# Altium schematic sheet AICat.SchDoc
size A3
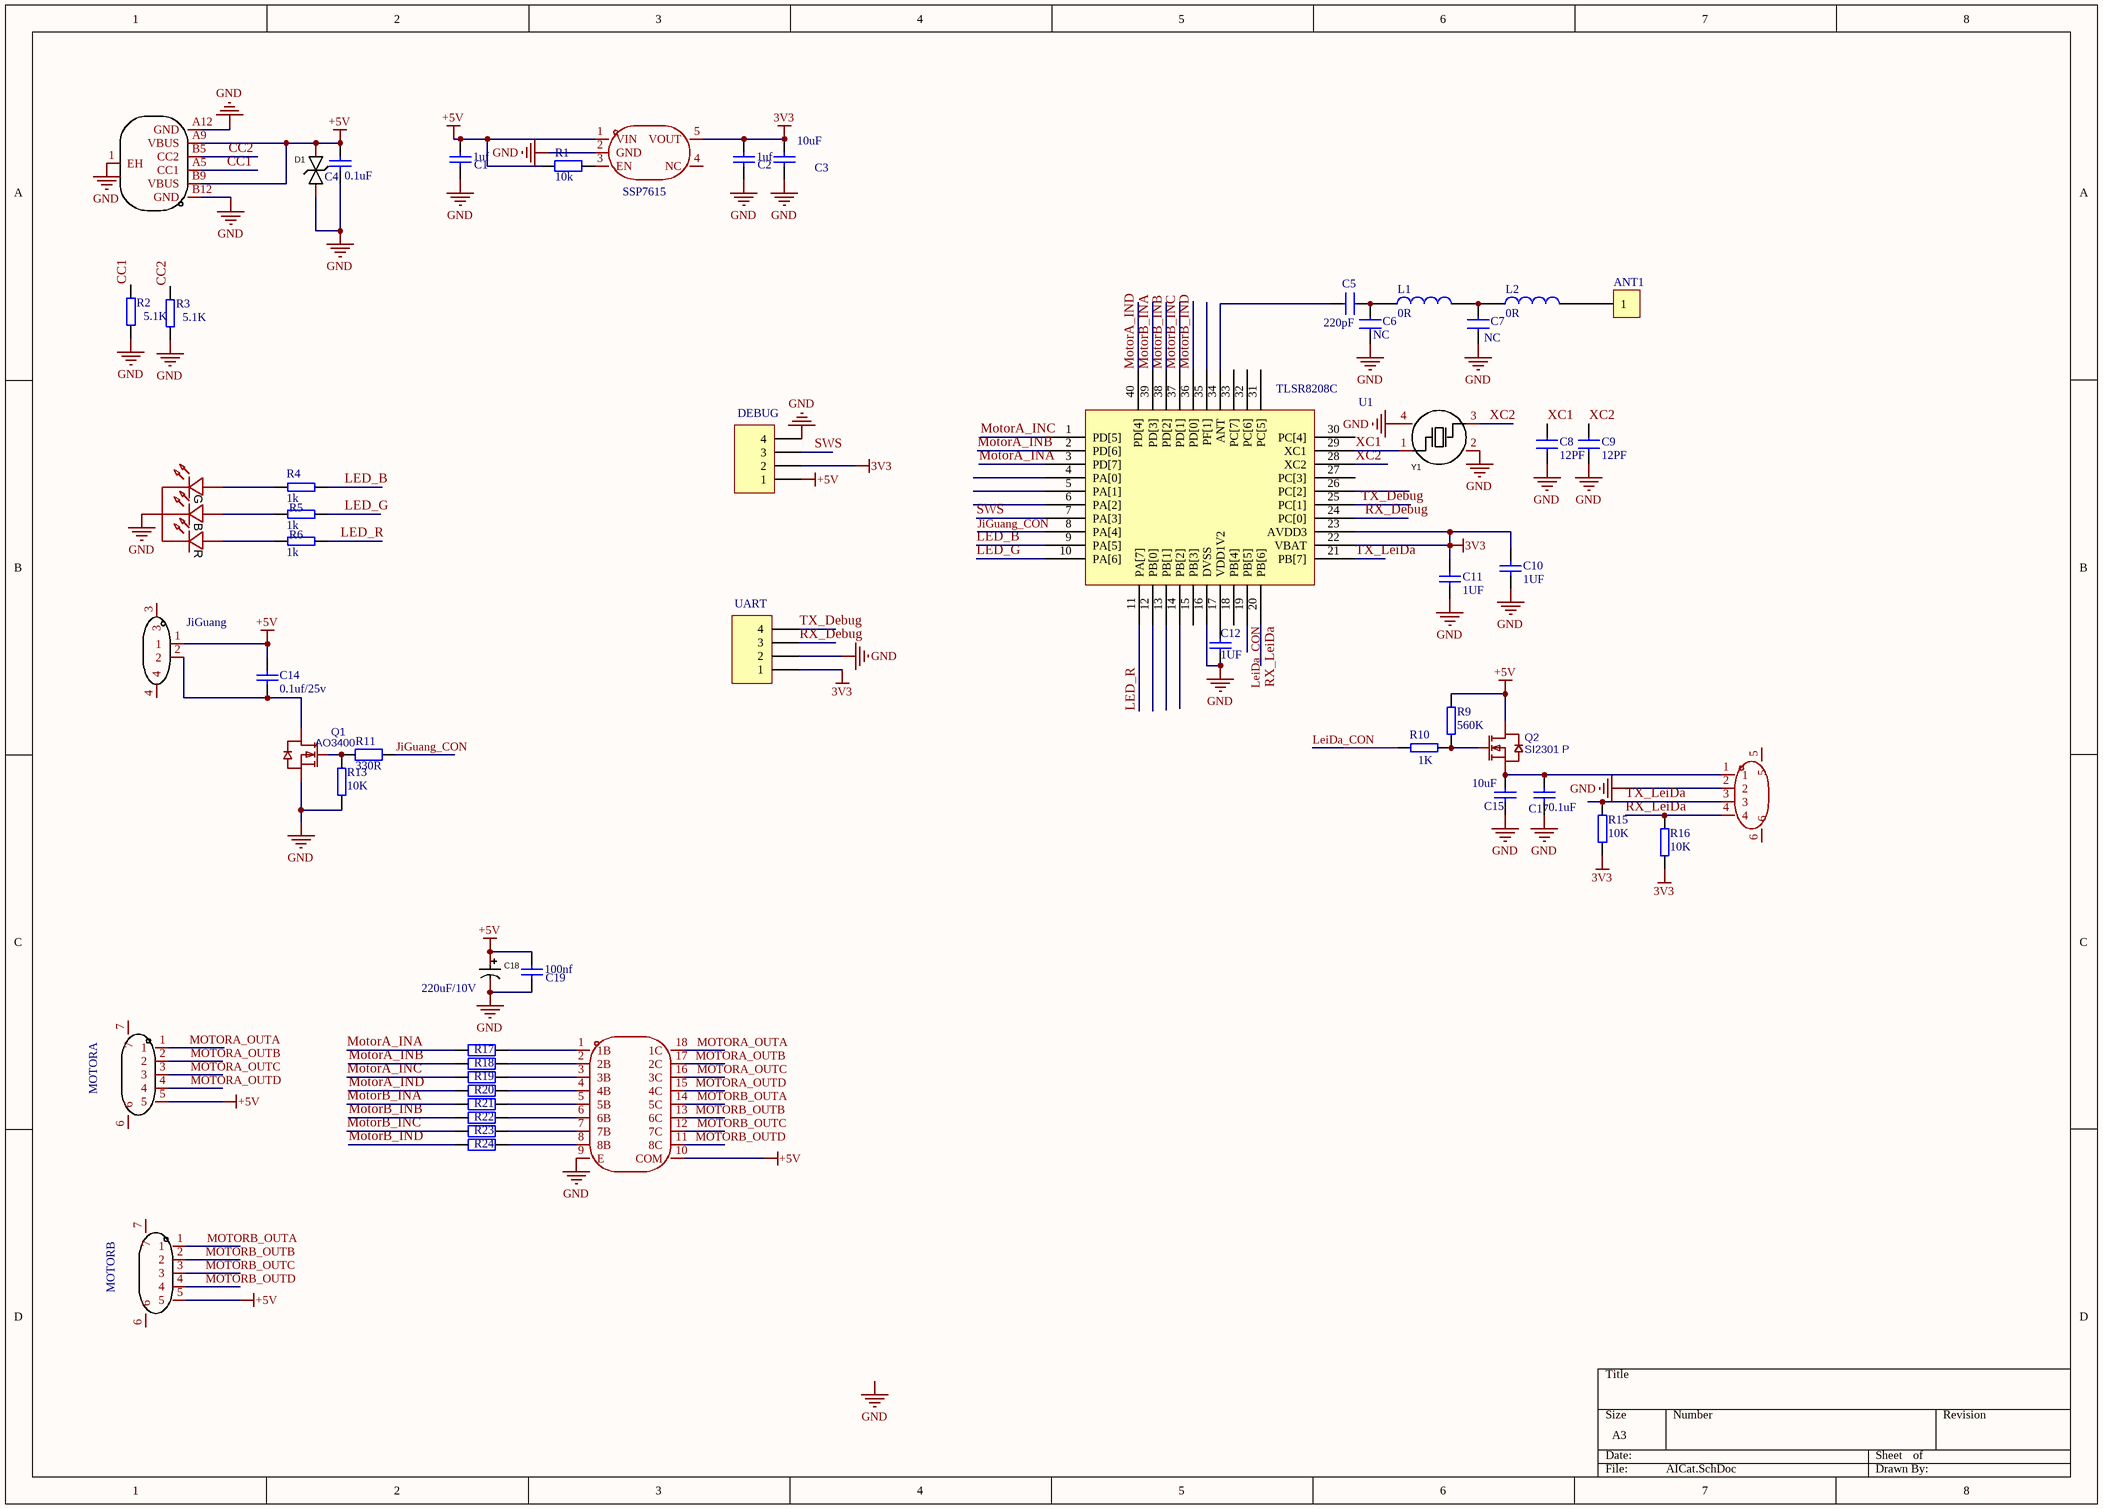
[diagram p0: AICat.SchDoc]

## Parts
ANT1  (no value)  [tp]
C1  1uf  [0603_C]
C2  1uf  [0603_C]
C3  10uF  [0805_C]
C4  0.1uF  [0603_C]
C5  220pF  [0603_c]
C6  NC  [0603_c]
C7  NC  [0603_c]
C8  12PF  [0603_c]
C9  12PF  [0603_c]
C10  1UF  [0603_c]
C11  1UF  [0603_c]
C12  1UF  [0603_c]
C14  0.1uf/25v  [0603_C]
C15  10uF  [0805_C]
C17  0.1uF  [0603_C]
C18  220uF/10V  [SMD 6.3*5.4 电解]
C19  100nf  [0603_C]
CN2  JiGuang  [CONN-SMD_2P-P1.25-LT]
CN4  HC-1.25-4PLT  [CONN-SMD_4P-P1.25_LT]  (value not drawn)
D1  SMF5.0CA_C726939  [SOD-123 双向]  (value not drawn)
J1  MOTORA  [CONN-SMD_1.25-5PLT]
J2  MOTORB  [CONN-SMD_1.25-5PLT]
L1  0R  [0603_r]
L2  0R  [0603_r]
LED1  MHSC110RGBCT  [LED-SMD_4P-L3.0-W1.5-L]  (value not drawn)
P1  DEBUG  [SIP4-2.54]
P2  UART  [SIP4-2.54]
Q1  AO3400  [SOT-23]
Q2  SI2301 P  [SOT-23]
R1  10k  [0603_R]
R2  5.1K  [0603_R]
R3  5.1K  [0603_R]
R4  1k  [0603_R]
R5  1k  [0603_R]
R6  1k  [0603_R]
R9  560K  [0603_R]
R10  1K  [0603_R]
R11  330R  [0603_R]
R13  10K  [0603_R]
R15  10K  [0603_R]
R16  10K  [0603_R]
R17  330R  [0603_R]  (value not drawn)
R18  330R  [0603_R]  (value not drawn)
R19  330R  [0603_R]  (value not drawn)
R20  330R  [0603_R]  (value not drawn)
R21  330R  [0603_R]  (value not drawn)
R22  330R  [0603_R]  (value not drawn)
R23  330R  [0603_R]  (value not drawn)
R24  330R  [0603_R]  (value not drawn)
U1  TLSR8208C  [QFN-40_L5.0-W5.0-P0.40-BL-EP3.7]
U2  ULN2803A  [SOIC-18_L11.6-W7.5-P1.27-LS10.3-BL]  (value not drawn)
U4  SSP7615  [SOT-23-5]
USB1  TYPE-C 6P  [TPYE-C-6]  (value not drawn)
Y1  24MHz +-20PPM  [CRYSTAL-SMD_4P-L3.2-W2.5]  (value not drawn)

## Nets
3V3: C2.2 C3.2 C10.1 C11.1 P1.2 P2.1 R15.2 R16.2 U1.22(VBAT) U1.23(AVDD3) U4.5(VOUT)
+5V: C1.2 C4.2 C14.2 C18.1 C19.2 CN2.1 D1.2 J1.5 J2.5 P1.1 Q2.2(D) R1.1 R9.1 U2.10(COM) U4.1(VIN) USB1.A9(VBUS) USB1.B9(VBUS)
GND: C1.1 C2.1 C3.1 C4.1 C6.1 C7.1 C8.1 C9.1 C10.2 C11.2 C12.1 C15.1 C17.1 C18.2 C19.1 CN4.2 D1.1 LED1.1 P1.4 P2.2 Q1.2(S) R2.2 R3.2 R13.1 U1.16(DVSS) U2.9(E) U4.2(GND) USB1.1(EH) USB1.A12(GND) USB1.B12(GND) Y1.2(GND) Y1.4(GND)
CC1: R2.1 USB1.A5(CC1)
CC2: R3.1 USB1.B5(CC2)
JiGuang_CON: R11.2 U1.8(PA[4])
LED_B: R4.2 U1.9(PA[5])
LED_G: R5.2 U1.10(PA[6])
LED_R: R6.2 U1.11(PA[7])
LeiDa_CON: R10.2 U1.19(PB[5])
MotorA_INA: R17.2 U1.3(PD[7])
MotorA_INB: R18.2 U1.2(PD[6])
MotorA_INC: R19.2 U1.1(PD[5])
MotorA_IND: R20.2 U1.40(PD[4])
MOTORA_OUTA: J1.1 U2.18(1C)
MOTORA_OUTB: J1.2 U2.17(2C)
MOTORA_OUTC: J1.3 U2.16(3C)
MOTORA_OUTD: J1.4 U2.15(4C)
MotorB_INA: R21.2 U1.39(PD[3])
MotorB_INB: R22.2 U1.38(PD[2])
MotorB_INC: R23.2 U1.37(PD[1])
MotorB_IND: R24.2 U1.36(PD[0])
MOTORB_OUTA: J2.1 U2.14(5C)
MOTORB_OUTB: J2.2 U2.13(6C)
MOTORB_OUTC: J2.3 U2.12(7C)
MOTORB_OUTD: J2.4 U2.11(8C)
RX_Debug: P2.3 U1.24(PC[0])
RX_LeiDa: CN4.4 R16.1 U1.20(PB[6])
SWS: P1.3 U1.7(PA[3])
TX_Debug: P2.4 U1.25(PC[1])
TX_LeiDa: CN4.3 R15.1 U1.21(PB[7])
XC1: C8.2 U1.29(XC1) Y1.1(OSC1)
XC2: C9.2 U1.28(XC2) Y1.3(OSC2)
NetANT1_1: ANT1.1 L2.2
NetC5_1: C5.1 U1.34(ANT)
NetC5_2: C5.2 C6.2 L1.1
NetC7_2: C7.2 L1.2 L2.1
NetC12_2: C12.2 U1.17(VDD1V2)
NetC14_1: C14.1 CN2.2 Q1.3(D)
NetC15_2: C15.2 C17.2 CN4.1 Q2.3(S)
NetLED1_2: LED1.2 R4.1
NetLED1_3: LED1.3 R5.1
NetLED1_4: LED1.4 R6.1
NetQ1_1: Q1.1(G) R11.1 R13.2
NetQ2_1: Q2.1(G) R9.2 R10.1
NetR1_2: R1.2 U4.3(EN)
NetR17_1: R17.1 U2.1(1B)
NetR18_1: R18.1 U2.2(2B)
NetR19_1: R19.1 U2.3(3B)
NetR20_1: R20.1 U2.4(4B)
NetR21_1: R21.1 U2.5(5B)
NetR22_1: R22.1 U2.6(6B)
NetR23_1: R23.1 U2.7(7B)
NetR24_1: R24.1 U2.8(8B)

Not connected (* = marked no-connect by the designer): CN2 3 4; CN4 5 6; J1 6 7; J2 6 7; U1 4(PA[0]) 5(PA[1]) 6(PA[2]) 12(PB[0]) 13(PB[1]) 14(PB[2]) 15(PB[3]) 18(PB[4]) 26(PC[2]) 27(PC[3]) 30(PC[4]) 31(PC[5]) 32(PC[6]) 33(PC[7]) 35(PF[1]); U4 4(NC)

## Notes on the sheet
- Labels drawn without touching a wire or pin: GND
- (in symbol MHSC110RGBCT) G; B; R

## Library data of the parts
ANT1 = CON1: Connector
C1 C2 C19 = Cap1: 无极电容
C3 C14 C15 = Cap: Capacitor; Value: 10nF; Published: 8-Jun-2000; Revision: July-2002: Re-released for DXP Platform.; Publisher: Altium Limited
C4 C17 = Cap: Capacitor; Value: 50V/0.1uF/0603; Published: 8-Jun-2000; Revision: July-2002: Re-released for DXP Platform.; Publisher: Altium Limited
C5-C9 = CAP: Capacitor
C10-C12 = CAP
C18 = RVT1A221M0605_C72494: Symbol: RVT1A221M0605-C72494; Value: 220uF; Add into BOM: yes; Rated Voltage: 10V; Ripple Current: 90mA@120Hz; L: 5.4mm; Device: RVT1A221M0605_C72494; Supplier: LCSC; Manufacturer Part: RVT1A221M0605; Supplier Part: C72494; JLCPCB Part Class: Extended Part; Supplier Footprint: SMD,D6.3xL5.4mm; Datasheet: https://atta.szlcsc.com/upload/public/pdf/source/20170325/1490427950282.pdf; Convert to PCB: yes; Equivalent Series Resistance(ESR): -
CN2 = HC-1.25-2PLT: Add into BOM: yes; Pins Structure: 1x2P; Pitch: 1.25mm; Number of PINs Per Row: 2; Current Rating (Max): 2A; Symbol: HC-1.25-2PLT; Device: HC-1.25-2PLT; Supplier Part: C2845388; Manufacturer Part: HC-1.25-2PLT; Supplier Footprint: SMD,P=1.25mm; JLCPCB Part Class: Extended Part; Datasheet: https://atta.szlcsc.com/upload/public/pdf/source/20230707/8E5913B5A3195C18F5EE12EA4CB86B82.pdf; Supplier: LCSC; Convert to PCB: yes; Reference Series: -; Number of Pins: 2P; Number of Rows: 1; Row Spacing: -
D1 = SMF5.0CA_C726939: Add into BOM: yes; Symbol: SMF5.0CA_C726939; Device: SMF5.0CA_C726939; Supplier: LCSC; Supplier Part: C726939; Manufacturer Part: SMF5.0CA; JLCPCB Part Class: Extended Part; LCSC Part Name: SMF5.0CA; Supplier Footprint: SOD-123FL; Datasheet: https://atta.szlcsc.com/upload/public/pdf/source/20200825/C726891_B615A55314C94A3B16B7FBCD32D40567.pdf; Convert to PCB: yes
J1 J2 = HC-1.25-5PLT: Add into BOM: yes; Pins Structure: 1x5P; Pitch: 1.25mm; Number of PINs Per Row: 5; Current Rating (Max): 2A; Symbol: HC-1.25-5PLT; Device: HC-1.25-5PLT; Supplier Part: C2845391; Manufacturer Part: HC-1.25-5PLT; Supplier Footprint: SMD,P=1.25mm; JLCPCB Part Class: Extended Part; Datasheet: https://atta.szlcsc.com/upload/public/pdf/source/20230707/8E5913B5A3195C18F5EE12EA4CB86B82.pdf; Supplier: LCSC; Convert to PCB: yes; Reference Series: -; Number of Pins: 5P; Number of Rows: 1; Row Spacing: -
L1 L2 = INDUCTOR
P1 P2 = Header 4: Header, 4-Pin; LatestRevisionDate: 17-Jul-2002; LatestRevisionNote: Re-released for DXP Platform.; Publisher: Altium Limited
Q1 Q2 = JMTL3400A: Contributor: LCSC; BOM_Supplier: LCSC; BOM_Supplier Part: C2890442; BOM_Manufacturer Part: JMTL3400A; BOM_JLCPCB Part Class: Extended Part; spicePre: Q; spiceSymbolName: JMTL3400A
R1 R11 R17-R24 = Res2: Resistor; Value: 120R; Published: 8-Jun-2000; LatestRevisionDate: 17-Jul-2002; LatestRevisionNote: Re-released for DXP Platform.; PackageReference: AXIAL-0.4; Publisher: Altium Limited
R2-R6 R9 R10 R13 R15 R16 = RES
U2 = ULN2803A_C181731: Symbol: ULN2803A_C181731
U4 = SSP7615-33M5R: Symbol: SSP7615-33M5R
USB1 = TYPE-C 6P LTH6.5: Add into BOM: yes; Number of Ports: 1; Current Rating - Power (Max): 3A; Symbol: TYPE-C 6P LTH6.5; Device: TYPE-C 6P LTH6.5; Supplier: LCSC; Supplier Part: C5187463; Manufacturer Part: TYPE-C 6P LTH6.5; JLCPCB Part Class: Extended Part; Supplier Footprint: SMD; Datasheet: https://atta.szlcsc.com/upload/public/pdf/source/20220929/CF5EB2C50F637B805AA82EC2C8F335C3.pdf; Convert to PCB: yes; Connector Type: Type-C; Number of Contacts: 6P
Y1 = TAXM13.56M4RLBCCT2T: Name: 13.56MHz; Add into BOM: yes; Value: 13.56MHz; External load capacitor: 20pF; Device: TAXM13.56M4RLBCCT2T; Supplier Part: C164051; Manufacturer Part: TAXM13.56M4RLBCCT2T; Supplier Footprint: SMD3225-4P; JLCPCB Part Class: Extended Part; Datasheet: https://atta.szlcsc.com/upload/public/pdf/source/20171225/C164051_15141924799131203407.pdf; Supplier: LCSC; Convert to PCB: yes
CN4 = HC-1.25-4PLT: Symbol: HC-1.25-4PLT
LED1 = MHSC110RGBCT: Symbol: MHSC110RGBCT